# Altium schematic sheet Processor.SchDoc
size 420 x 297 mm
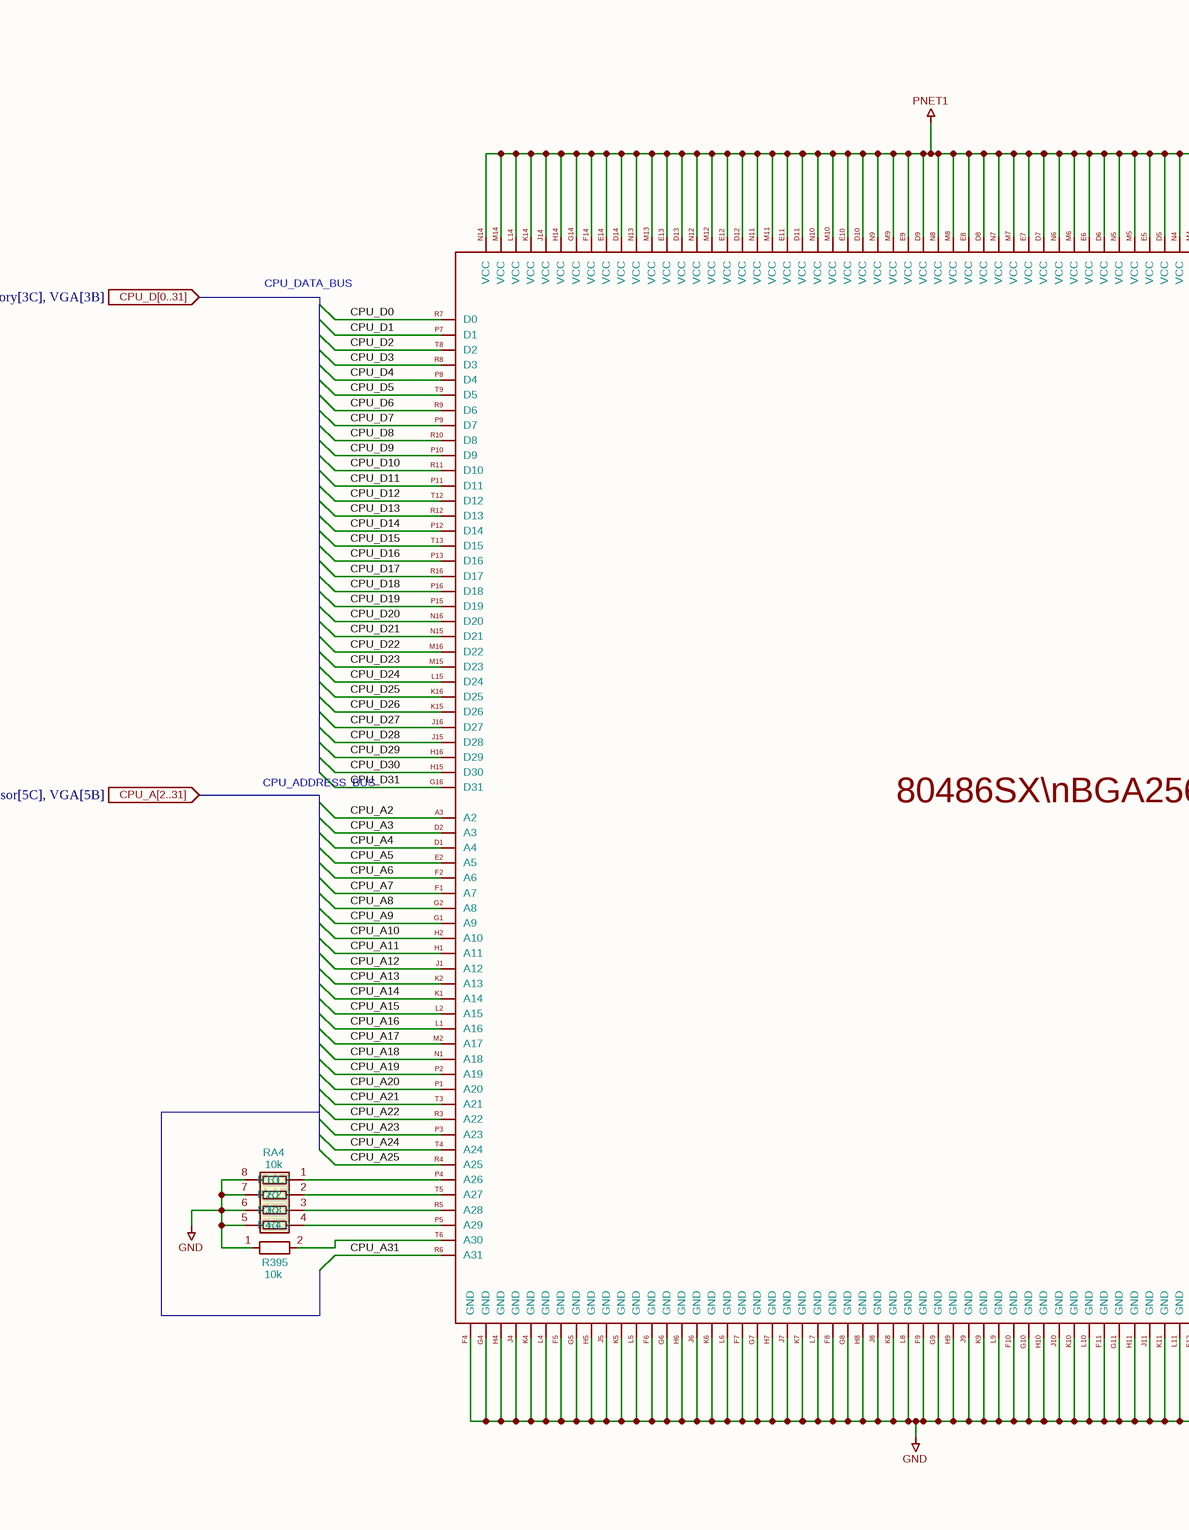
[diagram p0: Processor.SchDoc, left]
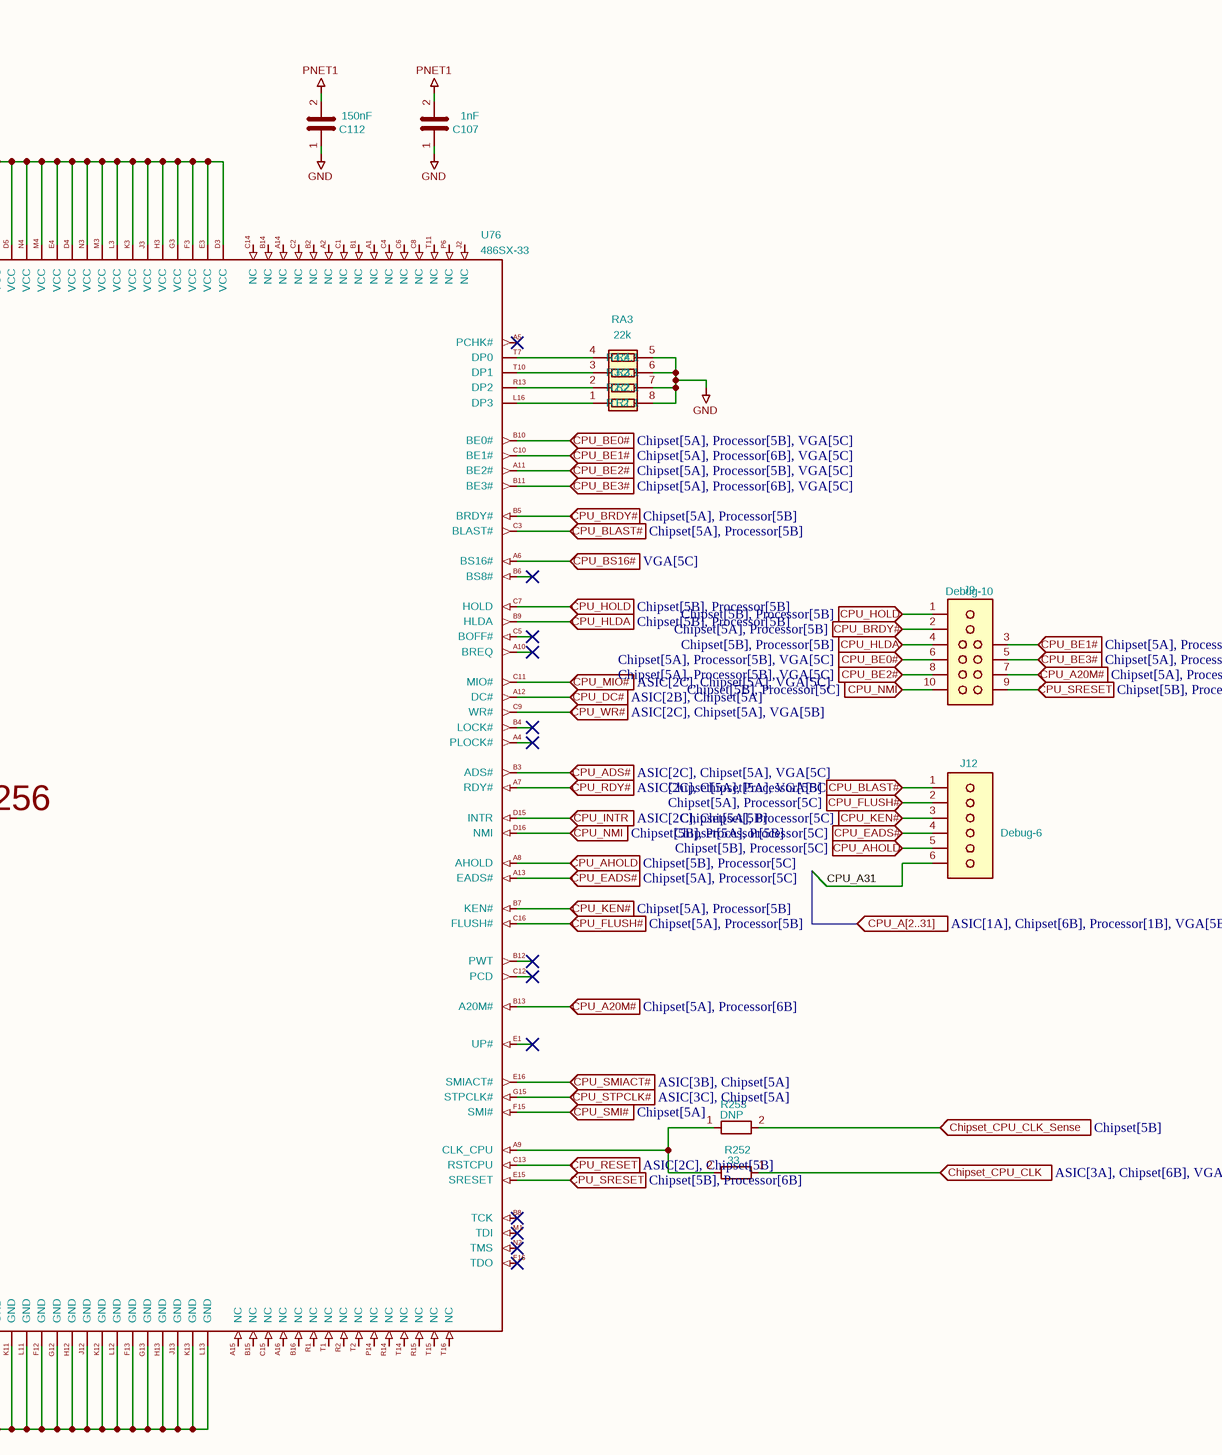
[diagram p1: Processor.SchDoc, right]

## Parts
C107  1nF  [C_0402_1005Metric]
C112  150nF  [C_0402_1005Metric]
J9  Debug-10  [Debug-10]
J12  Debug-6  [Debug-6]
R252  33  [R_0402_1005Metric]
R253  DNP  [R_0402_1005Metric]
R395  10k  [R_0402_1005Metric]
RA3  22k  [R-array]
RA4  10k  [R-array]
U76  486SX-33  [BGA-256]

## Ports
Chipset_CPU_CLK (in, see ASIC[3A], Chipset[6B], VGA[5C]), Chipset_CPU_CLK_Sense (in, see Chipset[5B]), CPU_A20M# (in, see Chipset[5A], Processor[5C]), CPU_A20M# (in, see Chipset[5A], Processor[6B]), CPU_A[2..31] (in, see ASIC[1A], Chipset[6B], Processor[1B], VGA[5B]), CPU_A[2..31] (in, see ASIC[1A], Chipset[6B], Processor[5C], VGA[5B]), CPU_ADS# (in, see ASIC[2C], Chipset[5A], VGA[5C]), CPU_AHOLD (in, see Chipset[5B], Processor[5C]), CPU_BE0# (in, see Chipset[5A], Processor[5B], VGA[5C]), CPU_BE1# (in, see Chipset[5A], Processor[5B], VGA[5C]), CPU_BE1# (in, see Chipset[5A], Processor[6B], VGA[5C]), CPU_BE2# (in, see Chipset[5A], Processor[5B], VGA[5C]), CPU_BE3# (in, see Chipset[5A], Processor[5B], VGA[5C]), CPU_BE3# (in, see Chipset[5A], Processor[6B], VGA[5C]), CPU_BLAST# (in, see Chipset[5A], Processor[5B]), CPU_BRDY# (in, see Chipset[5A], Processor[5B]), CPU_BS16# (in, see VGA[5C]), CPU_D[0..31] (in, see Chipset[2A], Memory[3B], Memory[3C], VGA[3B]), CPU_DC# (in, see ASIC[2B], Chipset[5A]), CPU_EADS# (in, see Chipset[5A], Processor[5C]), CPU_FLUSH# (in, see Chipset[5A], Processor[5B]), CPU_FLUSH# (in, see Chipset[5A], Processor[5C]), CPU_HLDA (in, see Chipset[5B], Processor[5B]), CPU_HOLD (in, see Chipset[5B], Processor[5B]), CPU_INTR (in, see ASIC[2C], Chipset[5B]), CPU_KEN# (in, see Chipset[5A], Processor[5B]), CPU_KEN# (in, see Chipset[5A], Processor[5C]), CPU_MIO# (in, see ASIC[2C], Chipset[5A], VGA[5C]), CPU_NMI (in, see Chipset[5B], Processor[5B]), CPU_NMI (in, see Chipset[5B], Processor[5C]), CPU_RDY# (in, see ASIC[2C], Chipset[5A], VGA[5C]), CPU_RESET (in, see ASIC[2C], Chipset[5B]), CPU_SMI# (in, see Chipset[5A]), CPU_SMIACT# (in, see ASIC[3B], Chipset[5A]), CPU_SRESET (in, see Chipset[5B], Processor[5C]), CPU_SRESET (in, see Chipset[5B], Processor[6B]), CPU_STPCLK# (in, see ASIC[3C], Chipset[5A]), CPU_WR# (in, see ASIC[2C], Chipset[5A], VGA[5B])

## Nets
GND: C107.1 C112.1 R395.1 RA3.5(R4.2) RA3.6(R3.2) RA3.7(R2.2) RA3.8(R1.2) RA4.5(R4.2) RA4.6(R3.2) RA4.7(R2.2) RA4.8(R1.2) U76.F4(GND) U76.F5(GND) U76.F6(GND) U76.F7(GND) U76.F8(GND) U76.F9(GND) U76.F10(GND) U76.F11(GND) U76.F12(GND) U76.F13(GND) U76.G4(GND) U76.G5(GND) U76.G6(GND) U76.G7(GND) U76.G8(GND) U76.G9(GND) U76.G10(GND) U76.G11(GND) U76.G12(GND) U76.G13(GND) U76.H4(GND) U76.H5(GND) U76.H6(GND) U76.H7(GND) U76.H8(GND) U76.H9(GND) U76.H10(GND) U76.H11(GND) U76.H12(GND) U76.H13(GND) U76.J4(GND) U76.J5(GND) U76.J6(GND) U76.J7(GND) U76.J8(GND) U76.J9(GND) U76.J10(GND) U76.J11(GND) U76.J12(GND) U76.J13(GND) U76.K4(GND) U76.K5(GND) U76.K6(GND) U76.K7(GND) U76.K8(GND) U76.K9(GND) U76.K10(GND) U76.K11(GND) U76.K12(GND) U76.K13(GND) U76.L4(GND) U76.L5(GND) U76.L6(GND) U76.L7(GND) U76.L8(GND) U76.L9(GND) U76.L10(GND) U76.L11(GND) U76.L12(GND) U76.L13(GND)
PNET1: C107.2 C112.2 U76.D3(VCC) U76.D4(VCC) U76.D5(VCC) U76.D6(VCC) U76.D7(VCC) U76.D8(VCC) U76.D9(VCC) U76.D10(VCC) U76.D11(VCC) U76.D12(VCC) U76.D13(VCC) U76.D14(VCC) U76.E3(VCC) U76.E4(VCC) U76.E5(VCC) U76.E6(VCC) U76.E7(VCC) U76.E8(VCC) U76.E9(VCC) U76.E10(VCC) U76.E11(VCC) U76.E12(VCC) U76.E13(VCC) U76.E14(VCC) U76.F3(VCC) U76.F14(VCC) U76.G3(VCC) U76.G14(VCC) U76.H3(VCC) U76.H14(VCC) U76.J3(VCC) U76.J14(VCC) U76.K3(VCC) U76.K14(VCC) U76.L3(VCC) U76.L14(VCC) U76.M3(VCC) U76.M4(VCC) U76.M5(VCC) U76.M6(VCC) U76.M7(VCC) U76.M8(VCC) U76.M9(VCC) U76.M10(VCC) U76.M11(VCC) U76.M12(VCC) U76.M13(VCC) U76.M14(VCC) U76.N3(VCC) U76.N4(VCC) U76.N5(VCC) U76.N6(VCC) U76.N7(VCC) U76.N8(VCC) U76.N9(VCC) U76.N10(VCC) U76.N11(VCC) U76.N12(VCC) U76.N13(VCC) U76.N14(VCC)
Chipset_CPU_CLK: R252.1 ; port Chipset_CPU_CLK
Chipset_CPU_CLK_Sense: R253.2 ; port Chipset_CPU_CLK_Sense
CPU_A2: U76.A3(A2)
CPU_A3: U76.D2(A3)
CPU_A4: U76.D1(A4)
CPU_A5: U76.E2(A5)
CPU_A6: U76.F2(A6)
CPU_A7: U76.F1(A7)
CPU_A8: U76.G2(A8)
CPU_A9: U76.G1(A9)
CPU_A10: U76.H2(A10)
CPU_A11: U76.H1(A11)
CPU_A12: U76.J1(A12)
CPU_A13: U76.K2(A13)
CPU_A14: U76.K1(A14)
CPU_A15: U76.L2(A15)
CPU_A16: U76.L1(A16)
CPU_A17: U76.M2(A17)
CPU_A18: U76.N1(A18)
CPU_A19: U76.P2(A19)
CPU_A20: U76.P1(A20)
CPU_A20M#: J9.7 U76.B13(A20M#) ; port CPU_A20M#
CPU_A21: U76.T3(A21)
CPU_A22: U76.R3(A22)
CPU_A23: U76.P3(A23)
CPU_A24: U76.T4(A24)
CPU_A25: U76.R4(A25)
CPU_A31: J12.6 U76.R6(A31)
CPU_ADS#: U76.B3(ADS#) ; port CPU_ADS#
CPU_AHOLD: J12.5 U76.A8(AHOLD) ; port CPU_AHOLD
CPU_BE0#: J9.6 U76.B10(BE0#) ; port CPU_BE0#
CPU_BE1#: J9.3 U76.C10(BE1#) ; port CPU_BE1#
CPU_BE2#: J9.8 U76.A11(BE2#) ; port CPU_BE2#
CPU_BE3#: J9.5 U76.B11(BE3#) ; port CPU_BE3#
CPU_BLAST#: J12.1 U76.C3(BLAST#) ; port CPU_BLAST#
CPU_BRDY#: J9.2 U76.B5(BRDY#) ; port CPU_BRDY#
CPU_BS16#: U76.A6(BS16#) ; port CPU_BS16#
CPU_D0: U76.R7(D0)
CPU_D1: U76.P7(D1)
CPU_D2: U76.T8(D2)
CPU_D3: U76.R8(D3)
CPU_D4: U76.P8(D4)
CPU_D5: U76.T9(D5)
CPU_D6: U76.R9(D6)
CPU_D7: U76.P9(D7)
CPU_D8: U76.R10(D8)
CPU_D9: U76.P10(D9)
CPU_D10: U76.R11(D10)
CPU_D11: U76.P11(D11)
CPU_D12: U76.T12(D12)
CPU_D13: U76.R12(D13)
CPU_D14: U76.P12(D14)
CPU_D15: U76.T13(D15)
CPU_D16: U76.P13(D16)
CPU_D17: U76.R16(D17)
CPU_D18: U76.P16(D18)
CPU_D19: U76.P15(D19)
CPU_D20: U76.N16(D20)
CPU_D21: U76.N15(D21)
CPU_D22: U76.M16(D22)
CPU_D23: U76.M15(D23)
CPU_D24: U76.L15(D24)
CPU_D25: U76.K16(D25)
CPU_D26: U76.K15(D26)
CPU_D27: U76.J16(D27)
CPU_D28: U76.J15(D28)
CPU_D29: U76.H16(D29)
CPU_D30: U76.H15(D30)
CPU_D31: U76.G16(D31)
CPU_DC#: U76.A12(DC#) ; port CPU_DC#
CPU_EADS#: J12.4 U76.A13(EADS#) ; port CPU_EADS#
CPU_FLUSH#: J12.2 U76.C16(FLUSH#) ; port CPU_FLUSH#
CPU_HLDA: J9.4 U76.B9(HLDA) ; port CPU_HLDA
CPU_HOLD: J9.1 U76.C7(HOLD) ; port CPU_HOLD
CPU_INTR: U76.D15(INTR) ; port CPU_INTR
CPU_KEN#: J12.3 U76.B7(KEN#) ; port CPU_KEN#
CPU_MIO#: U76.C11(MIO#) ; port CPU_MIO#
CPU_NMI: J9.10 U76.D16(NMI) ; port CPU_NMI
CPU_RDY#: U76.A7(RDY#) ; port CPU_RDY#
CPU_RESET: U76.C13(RSTCPU) ; port CPU_RESET
CPU_SMI#: U76.F15(SMI#) ; port CPU_SMI#
CPU_SMIACT#: U76.E16(SMIACT#) ; port CPU_SMIACT#
CPU_SRESET: J9.9 U76.E15(SRESET) ; port CPU_SRESET
CPU_STPCLK#: U76.G15(STPCLK#) ; port CPU_STPCLK#
CPU_WR#: U76.C9(WR#) ; port CPU_WR#
NetR252_2: R252.2 R253.1 U76.A9(CLK_CPU)
NetR395_2: R395.2 U76.T6(A30)
NetRA3_1: RA3.1(R1.1) U76.L16(DP3)
NetRA3_2: RA3.2(R2.1) U76.R13(DP2)
NetRA3_3: RA3.3(R3.1) U76.T10(DP1)
NetRA3_4: RA3.4(R4.1) U76.T7(DP0)
NetRA4_1: RA4.1(R1.1) U76.P4(A26)
NetRA4_2: RA4.2(R2.1) U76.T5(A27)
NetRA4_3: RA4.3(R3.1) U76.R5(A28)
NetRA4_4: RA4.4(R4.1) U76.P5(A29)

Not connected (* = marked no-connect by the designer): U76 A1(NC) A2(NC) A4(PLOCK#)* A5(PCHK#)* A10(BREQ)* A14(NC) A15(NC) A16(NC) B1(NC) B2(NC) B4(LOCK#)* B6(BS8#)* B8(TCK)* B12(PWT)* B14(NC) B15(NC) B16(NC) C1(NC) C2(NC) C4(NC) C5(BOFF#)* C6(NC) C8(NC) C12(PCD)* C14(NC) C15(NC) E1(UP#)* F16(TDO)* J2(NC) M1(TDI)* N2(TMS)* P6(NC) P14(NC) R1(NC) R2(NC) R14(NC) R15(NC) T1(NC) T2(NC) T11(NC) T14(NC) T15(NC) T16(NC)

## Notes on the sheet
- CPU_DATA_BUS
- CPU_ADDRESS_BUS
- 1
- 2
- 3
- 4
- 5
- 6
- 7
- 8
- A
- B
- C
- D
- E
- Title: PC110
- File: Processor.kicad_sch
- Sheet: /
- Recreated by: Ahmad Byagowi
- F
- KiCad E.D.A.  kicad (5.1.4)-1
- Size: A3
- Date:
- Rev:
- Id: 1/1
- (in symbol 80486SX) 80486SX\nBGA256

## Library data of the parts
C107 C112 = C: Footprint: Capacitor_SMD:C_0402_1005Metric
  C107: Value: 1nF
  C112: Value: 150nF
J9 = CPU_Debug10: Value: Debug-10; Footprint: PC110:Debug-10
J12 = CPU_Debug6: Value: Debug-6; Footprint: PC110:Debug-6
R252 R253 R395 = R
  R252: Value: 33; Footprint: PCM_Resistor_SMD_AKL:R_0402_1005Metric
  R253: Value: DNP; Footprint: PCM_Resistor_SMD_AKL:R_0402_1005Metric
  R395: Value: 10k; Footprint: Resistor_SMD:R_0402_1005Metric
RA3 RA4 = R_Pack04: Footprint: PC110:R-array
  RA3: Value: 22k
  RA4: Value: 10k
U76 = 80486SX: Value: 486SX-33; Footprint: PC110:BGA-256